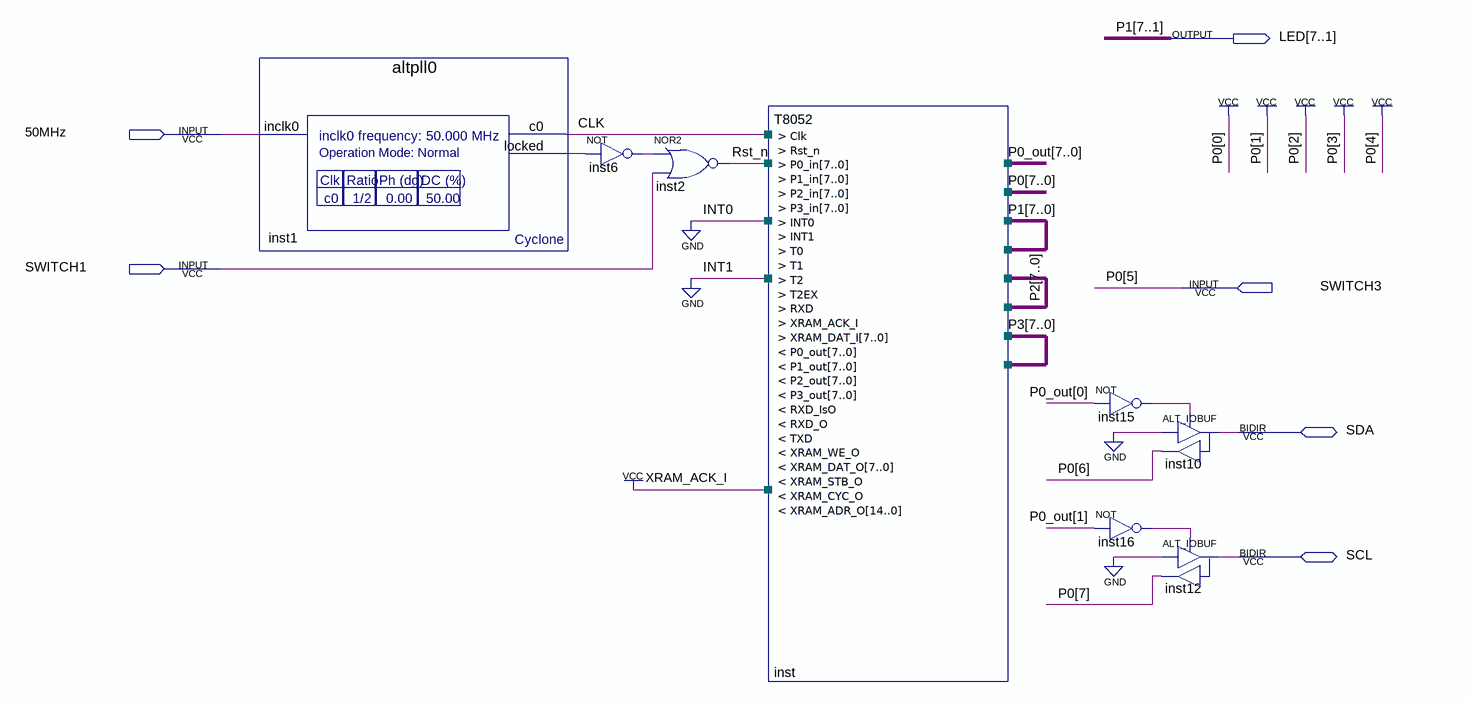
[diagram p0: schematic sheet]
// Quartus schematic ex9.bdf as structural Verilog: 8 symbols, 6 pins
module ex9 (
  input  \50MHz ,
  input  SWITCH1,
  input  SWITCH3,
  inout  SDA,
  inout  SCL,
  output [7:1] LED
);

  wire CLK, inst1_locked, inst6_out, inst15_out, inst16_out, Rst_n;
  wire [0:0] P1;
  wire [7:0] P0_out, P2, P3;
  wire [7:6] P0;

  altpll0 inst1 (.inclk0(\50MHz ), .c0(CLK), .locked(inst1_locked));
  not inst6 (inst6_out, inst1_locked);
  nor inst2 (Rst_n, inst6_out, SWITCH1);
  T8052 inst (
    .Clk(CLK), .Rst_n(Rst_n), .P0_in({P0, SWITCH3, {5{1'b1}}}), .P1_in({LED, P1[0]}), .P2_in(P2), .P3_in(P3),
    .INT0(1'b0), .INT1(1'b0), .XRAM_ACK_I(1'b1), .P0_out(P0_out), .P1_out({LED, P1[0]}), .P2_out(P2),
    .P3_out(P3));  // open: T0, T1, T2, T2EX, RXD, XRAM_DAT_I, RXD_IsO, RXD_O, TXD, XRAM_WE_O, XRAM_DAT_O, XRAM_STB_O, XRAM_CYC_O, XRAM_ADR_O
  not inst15 (inst15_out, P0_out[0]);
  ALT_IOBUF inst10 (.i(1'b0), .oe(inst15_out), .o(P0[6]), .io(SDA));
  not inst16 (inst16_out, P0_out[1]);
  ALT_IOBUF inst12 (.i(1'b0), .oe(inst16_out), .o(P0[7]), .io(SCL));

  // Other names for the same wires on the sheet: P0[5] = SWITCH3; P1[7:1] = LED
endmodule
